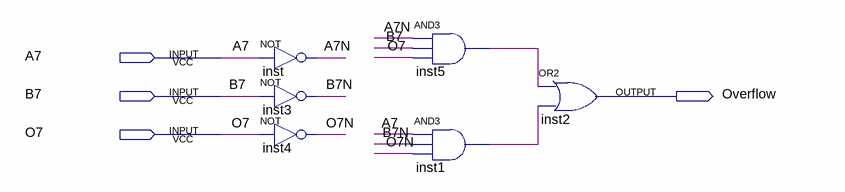
[diagram p0: schematic sheet]
// Quartus schematic Overflow_subtractor.bdf as structural Verilog: 6 symbols, 4 pins
module Overflow_subtractor (
  input  A7,
  input  B7,
  input  O7,
  output Overflow
);

  wire A7N, B7N, inst1_out, inst5_out, O7N;

  not inst (A7N, A7);
  not inst3 (B7N, B7);
  not inst4 (O7N, O7);
  and inst5 (inst5_out, A7N, B7, O7);
  and inst1 (inst1_out, A7, B7N, O7N);
  or inst2 (Overflow, inst5_out, inst1_out);
endmodule
